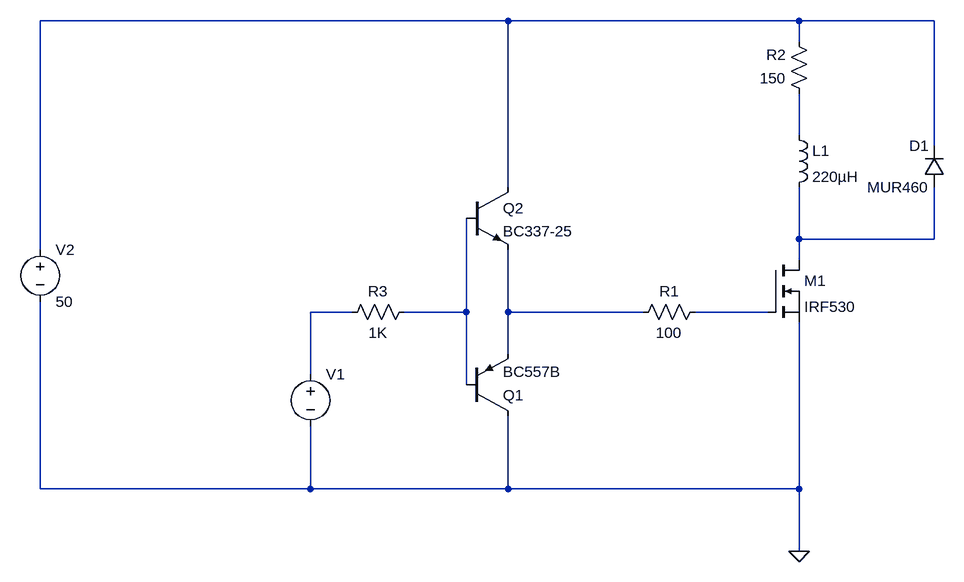
[diagram p0: schematic Conmutación MOSFET.asc]
Conmutación MOSFET.asc, the LTspice schematic file:
Version 4
SHEET 1 1380 680
WIRE 704 -192 -16 -192
WIRE 1152 -192 704 -192
WIRE 1360 -192 1152 -192
WIRE 1152 -160 1152 -192
WIRE 1152 -16 1152 -80
WIRE 1360 0 1360 -192
WIRE 704 64 704 -192
WIRE 1152 144 1152 64
WIRE 1360 144 1360 64
WIRE 1360 144 1152 144
WIRE -16 160 -16 -192
WIRE 1152 176 1152 144
WIRE 464 256 400 256
WIRE 640 256 640 112
WIRE 640 256 544 256
WIRE 704 256 704 160
WIRE 912 256 704 256
WIRE 1104 256 992 256
WIRE 704 320 704 256
WIRE 400 352 400 256
WIRE 640 368 640 256
WIRE -16 528 -16 240
WIRE 400 528 400 432
WIRE 400 528 -16 528
WIRE 704 528 704 416
WIRE 704 528 400 528
WIRE 1152 528 1152 272
WIRE 1152 528 704 528
WIRE 1152 624 1152 528
FLAG 1152 624 0
SYMBOL pnp 640 416 M180
SYMATTR InstName Q1
SYMATTR Value BC557B
SYMBOL npn 640 64 R0
SYMATTR InstName Q2
SYMATTR Value BC337-25
SYMBOL res 1008 240 R90
WINDOW 0 0 56 VBottom 2
WINDOW 3 32 56 VTop 2
SYMATTR InstName R1
SYMATTR Value 100
SYMBOL res 1168 -64 R180
WINDOW 0 36 76 Left 2
WINDOW 3 36 40 Left 2
SYMATTR InstName R2
SYMATTR Value 150
SYMBOL res 448 272 R270
WINDOW 0 32 56 VTop 2
WINDOW 3 0 56 VBottom 2
SYMATTR InstName R3
SYMATTR Value 1K
SYMBOL voltage 400 336 R0
WINDOW 123 0 0 Left 0
WINDOW 39 0 0 Left 0
SYMATTR InstName V1
SYMATTR Value ""
SYMBOL voltage -16 144 R0
WINDOW 123 0 0 Left 0
WINDOW 39 0 0 Left 0
SYMATTR InstName V2
SYMATTR Value 50
SYMBOL nmos 1104 176 R0
SYMATTR InstName M1
SYMATTR Value IRF530
SYMBOL ind 1136 -32 R0
SYMATTR InstName L1
SYMATTR Value 220µH
SYMBOL diode 1376 64 R180
WINDOW 0 24 64 Left 2
WINDOW 3 24 0 Left 2
SYMATTR InstName D1
SYMATTR Value MUR460

The netlist it stands for:
* Conmutación MOSFET.asc
Q1 0 N005 N006 0 BC557B
Q2 N001 N005 N006 0 BC337-25
R1 N007 N006 100
R2 N002 N001 150
R3 N004 N005 1K
V1 N004 0
V2 N001 0 50
M1 N003 N007 0 0 IRF530
L1 N002 N003 220µH
D1 N003 N001 MUR460
.model D D
.lib standard.dio
.model NPN NPN
.model PNP PNP
.lib standard.bjt
.model NMOS NMOS
.model PMOS PMOS
.lib standard.mos
.backanno
.end